# EasyEDA Pro project ProPrj_super_cap_ctrl_v1.0_2025-02-24.epro, schematic 主拓扑部分

## Sheets
1 Buck_Boost: Create Date: 2024-03-09; Page Name: Buck_Boost; Project Name: h桥电路test_v1.0; Schematic Name: 主拓扑部分; Update Date: 2024-06-20; Company: 嘉立创EDA; Page Size: A3; Version: V1.0
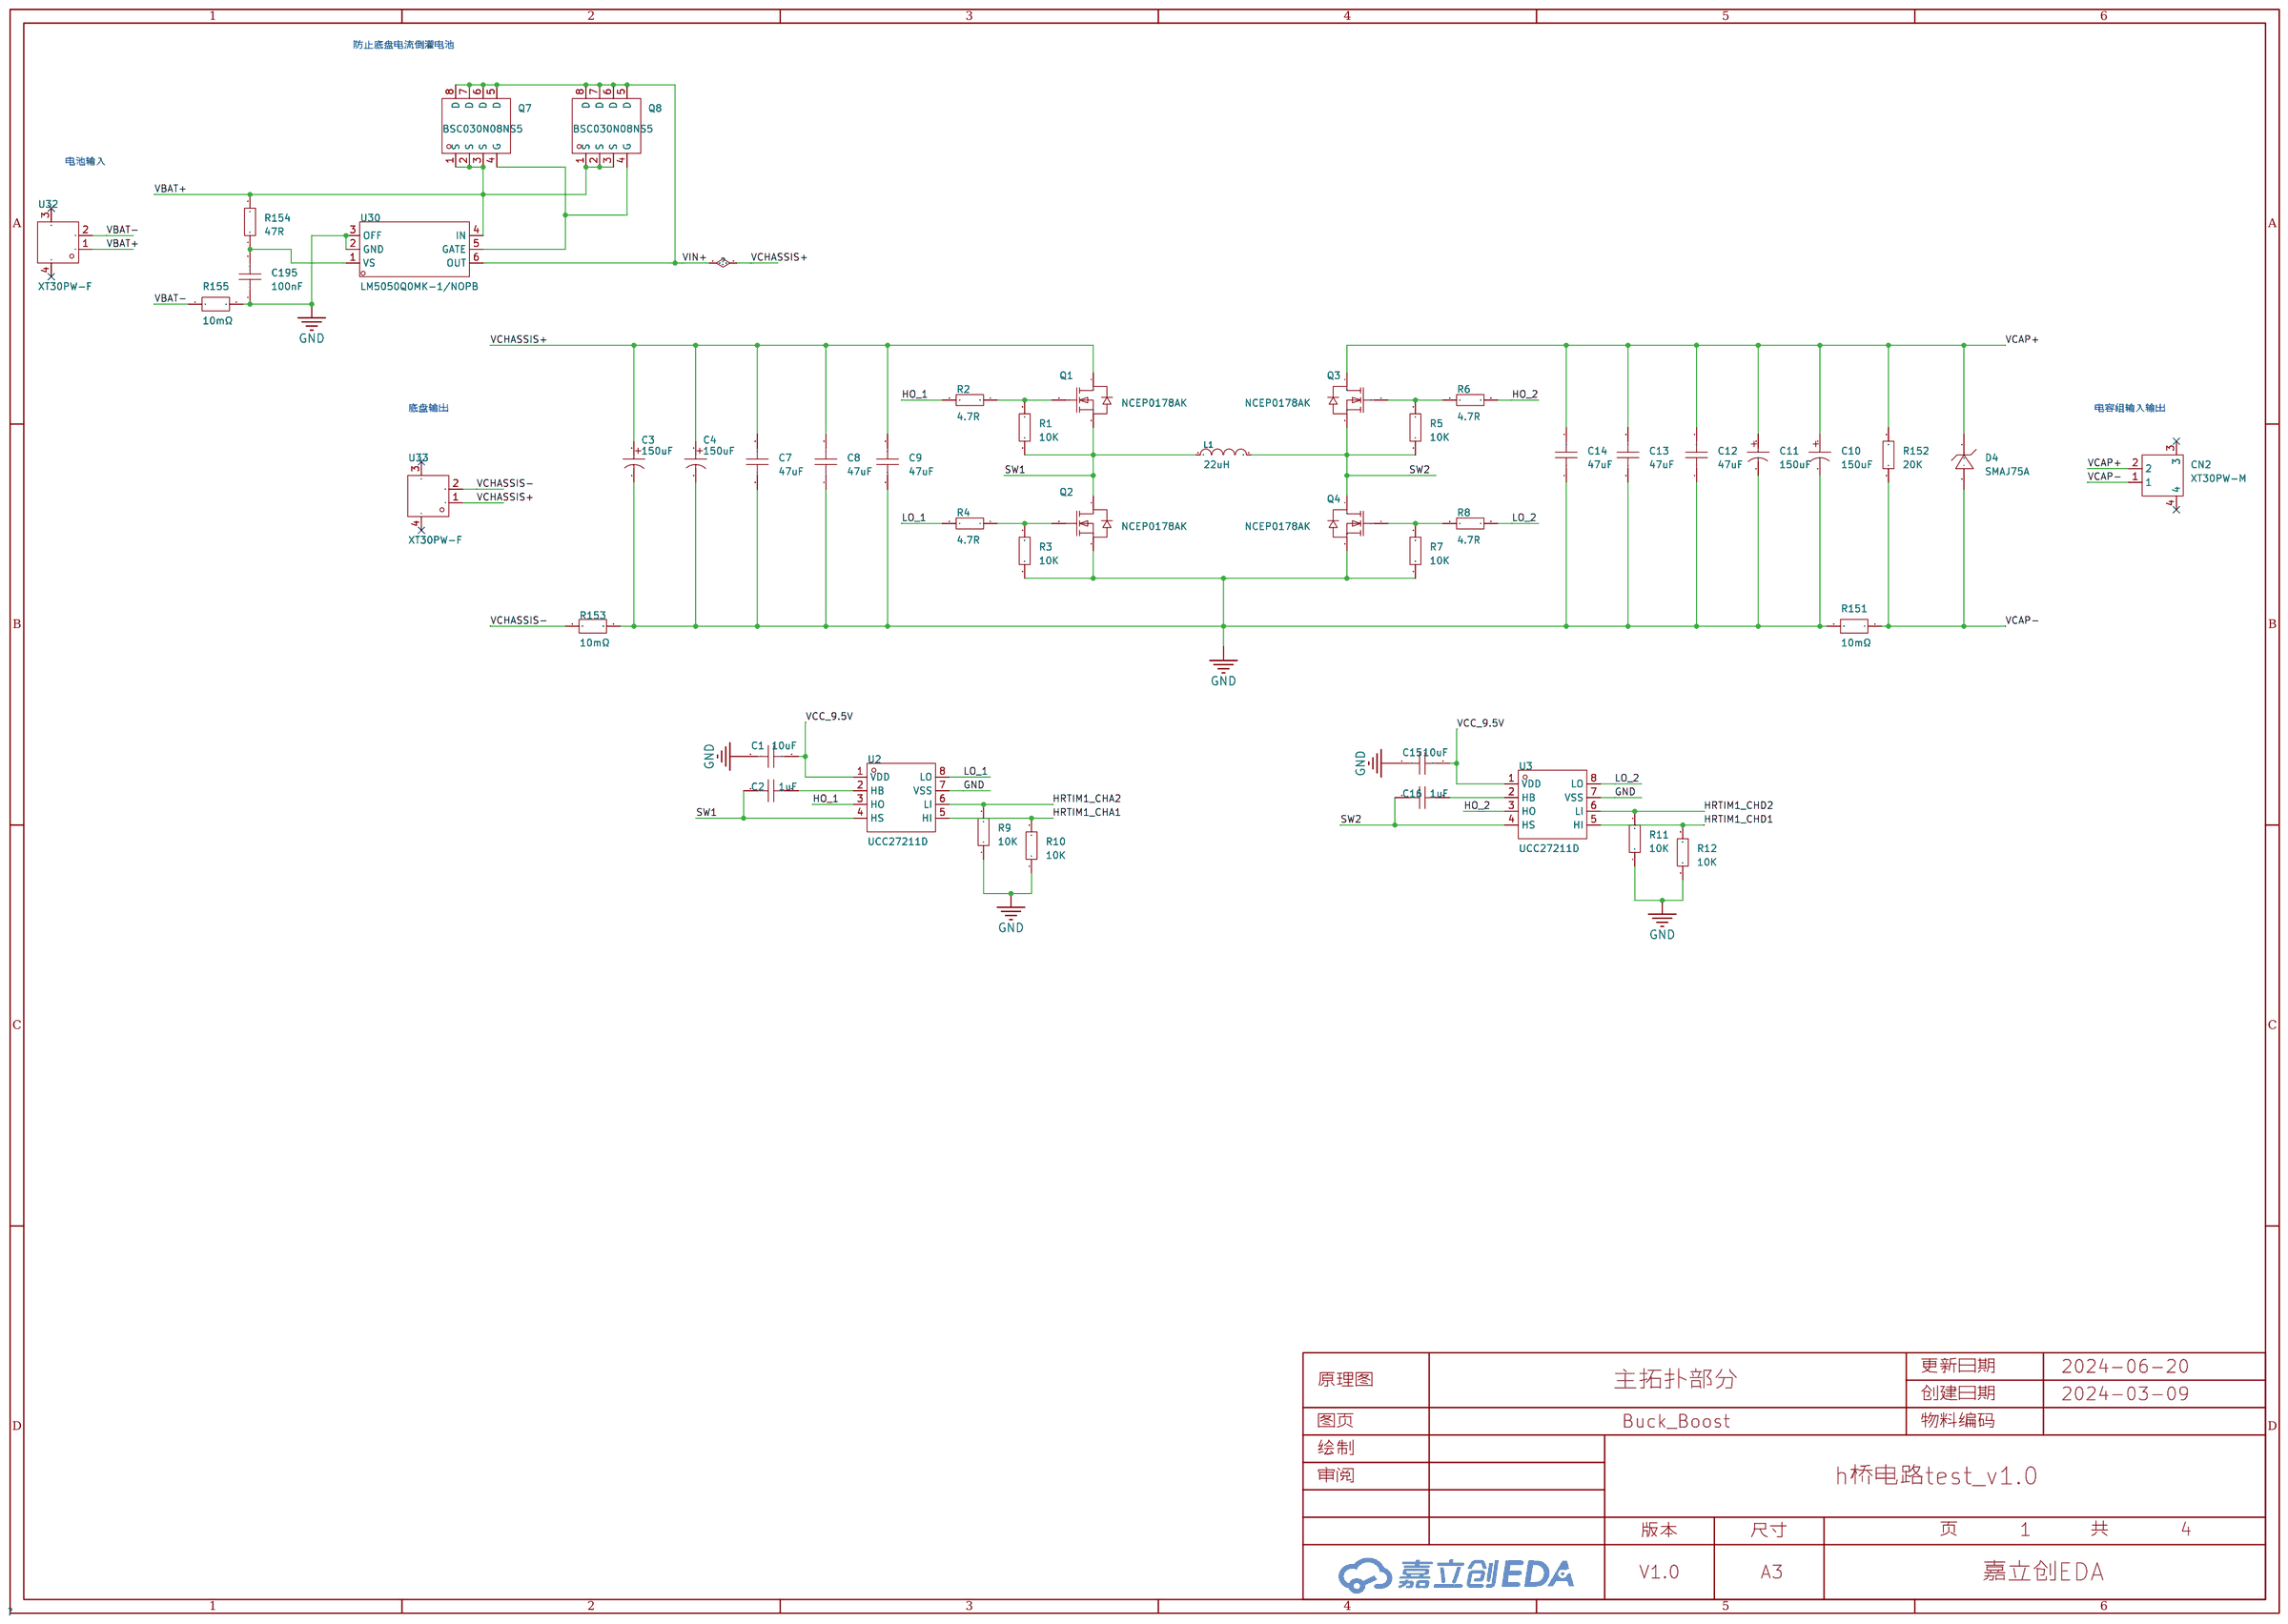
[diagram p0: Buck_Boost]
2 MCU: Create Date: 2024-03-11; Page Name: MCU; Update Date: 2024-05-17; Page Size: A4
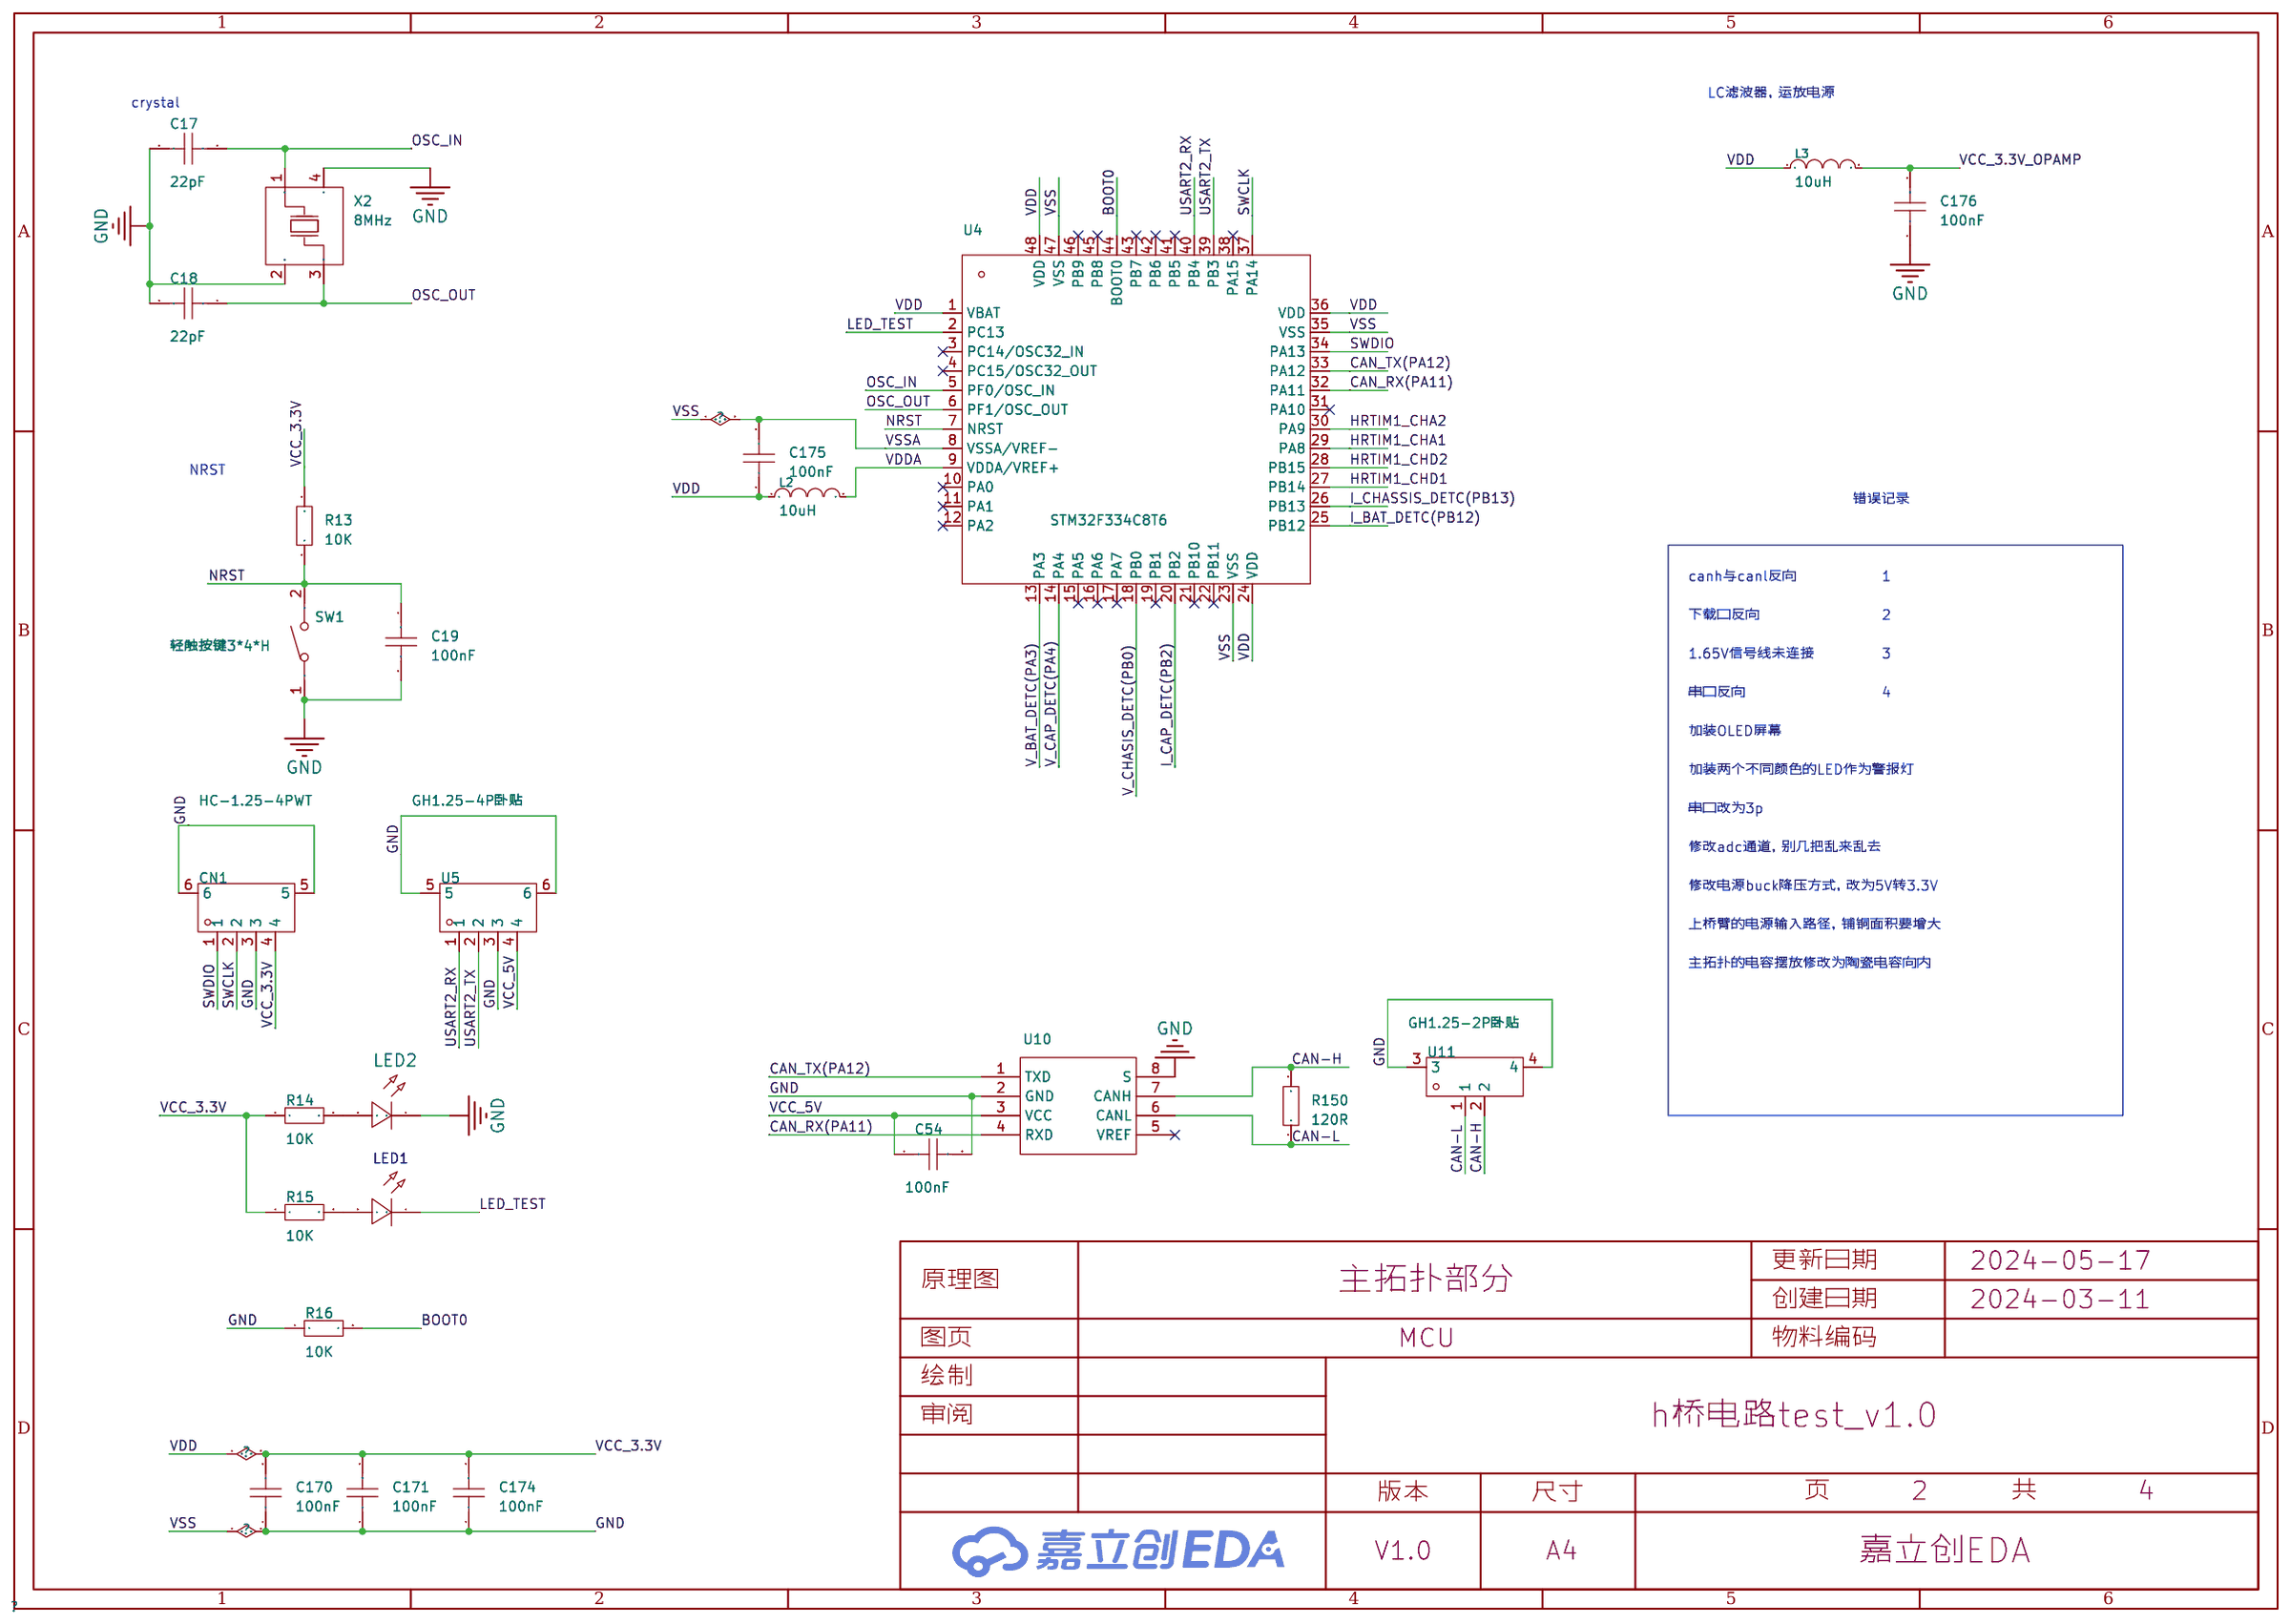
[diagram p1: MCU]
3 信号调理: Board Name: Board1; Create Date: 2024-03-11; Page Name: 信号调理; Update Date: 2024-05-14
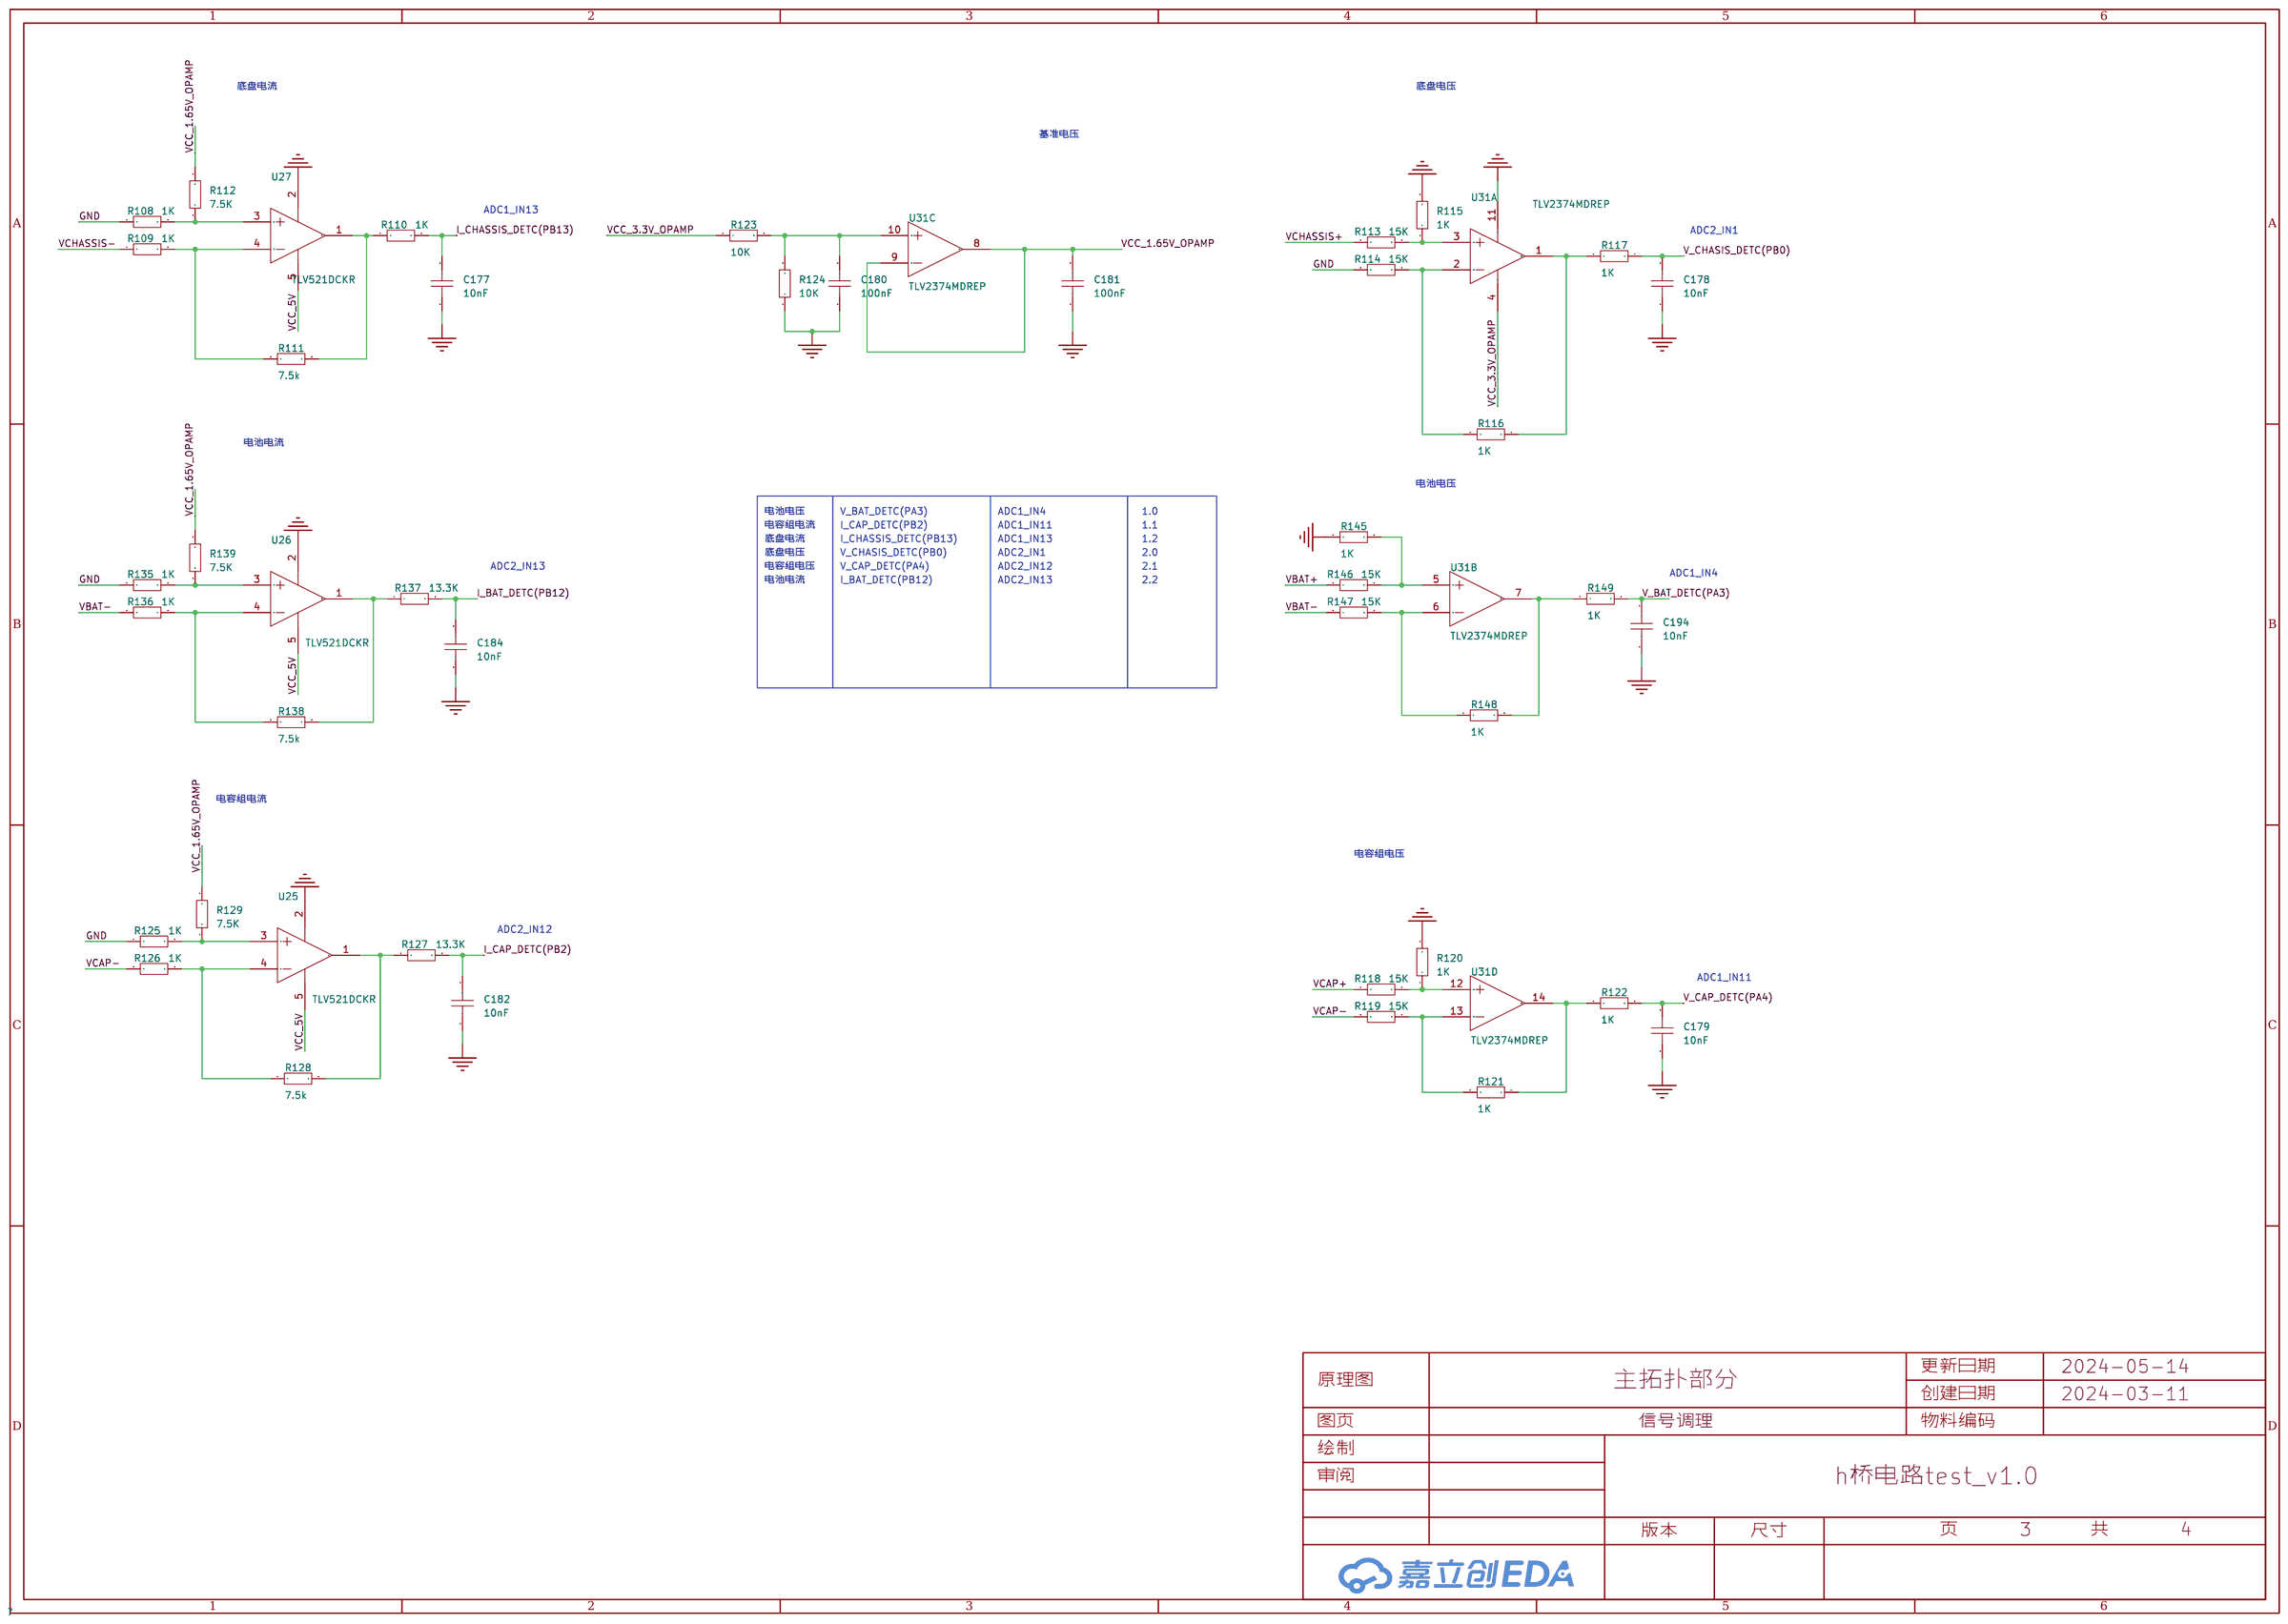
[diagram p2: 信号调理]
4 辅助电源: Create Date: 2024-03-11; Page Name: 辅助电源; Update Date: 2024-03-21; Page Size: A4
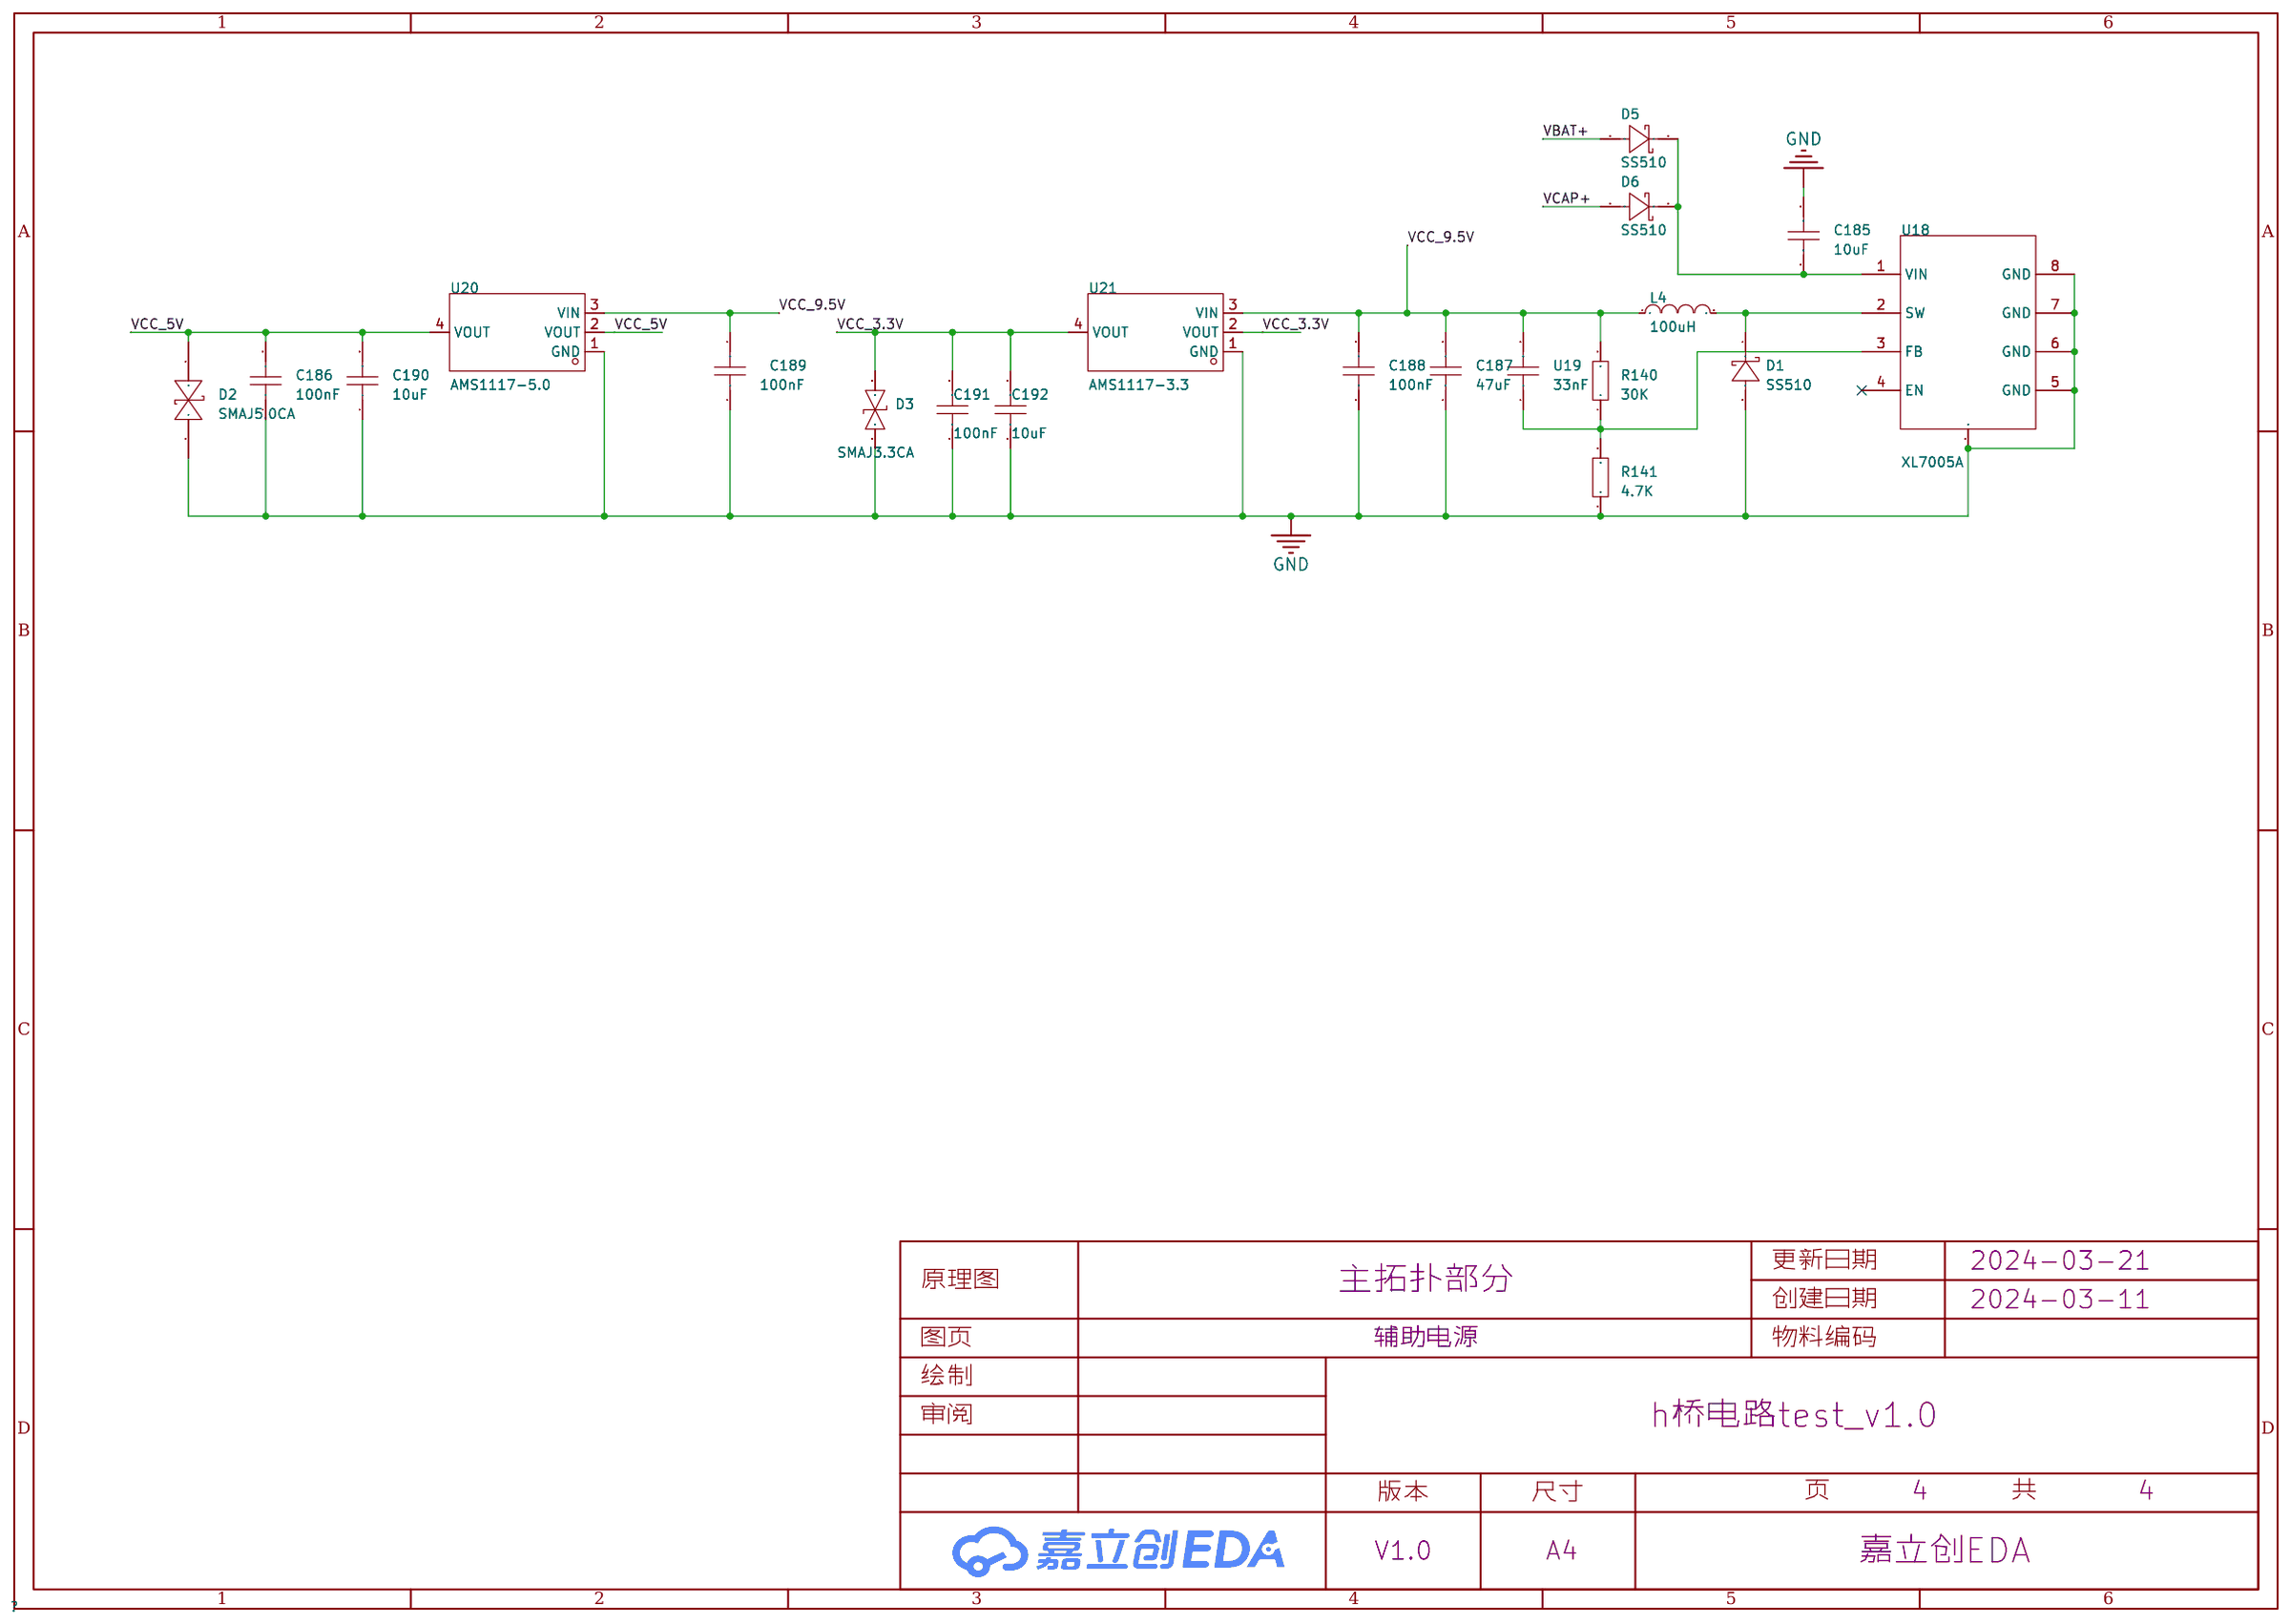
[diagram p3: 辅助电源]

## Parts
sheet Buck_Boost
C1  10uF  [C0603]
C2  1uF  [C0805]
C3  150uF  [CAP-SMD_BD10.0-L10.3-W10.3-LS11.3-FD]
C4  150uF  [CAP-SMD_BD10.0-L10.3-W10.3-LS11.3-FD]
C7  47uF  [C1210]
C8  47uF  [C1210]
C9  47uF  [C1210]
C10  150uF  [CAP-SMD_BD10.0-L10.3-W10.3-LS11.3-FD]
C11  150uF  [CAP-SMD_BD10.0-L10.3-W10.3-LS11.3-FD]
C12  47uF  [C1210]
C13  47uF  [C1210]
C14  47uF  [C1210]
C15  10uF  [C0603]
C16  1uF  [C0805]
C195  100nF  [C0603]
CN2  XT30PW-M  [CONN-TH_XT30PW-M]
D4  SMAJ75A  [SMA_L4.3-W2.6-LS5.0-RD]
L1  22uH  [IND-SMD_L17.2-W17.2]
Q1  NCEP0178AK  [TO-252-2_L6.5-W6.1-P4.58-LS10.0-TL]
Q2  NCEP0178AK  [TO-252-2_L6.5-W6.1-P4.58-LS10.0-TL]
Q3  NCEP0178AK  [TO-252-2_L6.5-W6.1-P4.58-LS10.0-TL]
Q4  NCEP0178AK  [TO-252-2_L6.5-W6.1-P4.58-LS10.0-TL]
Q7  BSC030N08NS5  [PG-TDSON-8_L5.0-W6.0-P1.27-BL-EP]
Q8  BSC030N08NS5  [PG-TDSON-8_L5.0-W6.0-P1.27-BL-EP]
R1  10K  [R0603]
R2  4.7R  [R0603]
R3  10K  [R0603]
R4  4.7R  [R0603]
R5  10K  [R0603]
R6  4.7R  [R0603]
R7  10K  [R0603]
R8  4.7R  [R0603]
R9  10K  [R0603]
R10  10K  [R0603]
R11  10K  [R0603]
R12  10K  [R0603]
R151  10mΩ  [RES-SMD_L6.4-W3.2-R2512]
R152  20K  [R1206]
R153  10mΩ  [RES-SMD_L6.4-W3.2-R2512]
R154  47R  [R0603]
R155  10mΩ  [RES-SMD_L6.4-W3.2-R2512]
U2  UCC27211D  [SOIC-8_L4.9-W3.9-P1.27-LS6.0-BL]
U3  UCC27211D  [SOIC-8_L4.9-W3.9-P1.27-LS6.0-BL]
U30  LM5050Q0MK-1/NOPB  [SOT-23-6_L2.9-W1.6-P0.95-LS2.8-BL]
U32  XT30PW-F  [CONN-TH_XT30PW-F-1]
U33  XT30PW-F  [CONN-TH_XT30PW-F-1]
sheet MCU
C17  22pF  [C0603]
C18  22pF  [C0603]
C19  100nF  [C0603]
C54  100nF  [C0603]
C170  100nF  [C0603]
C171  100nF  [C0603]
C174  100nF  [C0603]
C175  100nF  [C0603]
C176  100nF  [C0603]
CN1  HC-1.25-4PWT  [CONN-SMD_4P-P1.25-HC-1.25-4PWT]
L2  10uH  [L0603]
L3  10uH  [L0603]
LED1  -  [LED_0603]
LED2  -  [LED_0603]
R13  10K  [R0603]
R14  10K  [R0603]
R15  10K  [R0603]
R16  10K  [R0603]
R150  120R  [R0603]
SW1  轻触按键3*4*H  [SW-SMD_L4.0-W2.9-LS5.0]
U4  STM32F334C8T6  [LQFP-48_L7.0-W7.0-P0.50-LS9.0-BL]
U5  GH1.25-4P卧贴  [CONN-SMD_4P-P1.25_GH1.25-4P]
U10  -  [SOIC-8_L5.0-W4.0-P1.27-LS6.0-BL]
U11  GH1.25-2P卧贴  [CONN-SMD_2P-P1.25_GH1.25-2P]
X2  8MHz  [OSC-SMD_4P-L3.2-W2.5-BL]
sheet 信号调理
C177  10nF  [C0603]
C178  10nF  [C0603]
C179  10nF  [C0603]
C180  100nF  [C0603]
C181  100nF  [C0603]
C182  10nF  [C0603]
C184  10nF  [C0603]
C194  10nF  [C0603]
R108  1K  [R0603]
R109  1K  [R0603]
R110  1K  [R0603]
R111  7.5k  [R0603]
R112  7.5K  [R0603]
R113  15K  [R0603]
R114  15K  [R0603]
R115  1K  [R0603]
R116  1K  [R0603]
R117  1K  [R0603]
R118  15K  [R0603]
R119  15K  [R0603]
R120  1K  [R0603]
R121  1K  [R0603]
R122  1K  [R0603]
R123  10K  [R0603]
R124  10K  [R0603]
R125  1K  [R0603]
R126  1K  [R0603]
R127  13.3K  [R0603]
R128  7.5k  [R0603]
R129  7.5K  [R0603]
R135  1K  [R0603]
R136  1K  [R0603]
R137  13.3K  [R0603]
R138  7.5k  [R0603]
R139  7.5K  [R0603]
R145  1K  [R0603]
R146  15K  [R0603]
R147  15K  [R0603]
R148  1K  [R0603]
R149  1K  [R0603]
U25  TLV521DCKR  [SC-70-5_L2.1-W1.3-P0.65-LS2.1-BR]
U26  TLV521DCKR  [SC-70-5_L2.1-W1.3-P0.65-LS2.1-BR]
U27  TLV521DCKR  [SC-70-5_L2.1-W1.3-P0.65-LS2.1-BR]
U31  TLV2374MDREP  [SOIC-14_L8.7-W3.9-P1.27-LS6.0-BL]  (sections 1,2,3,4)
sheet 辅助电源
C185  10uF  [C1206]
C186  100nF  [C0603]
C187  47uF  [C1206]
C188  100nF  [C0603]
C189  100nF  [C0603]
C190  10uF  [C0603]
C191  100nF  [C0603]
C192  10uF  [C0603]
D1  SS510  [SMB_L4.3-W3.6-LS5.4-RD]
D2  SMAJ5.0CA  [SMA_L4.4-W2.8-LS5.1-BI]
D3  SMAJ3.3CA  [SMA_L4.3-W2.6-LS5.1-BI]
D5  SS510  [SMB_L4.3-W3.6-LS5.4-RD]
D6  SS510  [SMB_L4.3-W3.6-LS5.4-RD]
L4  100uH  [IND-SMD_L4.0-W4.0_FNR40XXS]
R140  30K  [R0603]
R141  4.7K  [R0603]
U18  XL7005A  [SOIC-8_L4.9-W3.9-P1.27-LS6.0-BL-EP3.1-1]
U19  33nF  [C0603]
U20  AMS1117-5.0  [SOT-223_L6.5-W3.5-P2.30-LS7.0-BR]
U21  AMS1117-3.3  [SOT-223-3_L6.5-W3.4-P2.30-LS7.0-BR]

## Library data of the parts
C1 C2 C15-C19 C170 C171 C174-C182 C184-C192 C194 C195 = CAP_0603: Supplier Footprint: 0603
C3 C4 C10 C11 = RVT1H151M1010: 容值:150uF;精度:±20%;额定电压:50V;纹波电流:178mA@120Hz;等效串联电阻:-;; LCSC Part Name: 150uF ±20% 50V; Supplier Part: C72490; Manufacturer: ROQANG(容强); Supplier Footprint: SMD,D10xL10.2mm; JLCPCB Part Class: 扩展库; Datasheet: https://atta.szlcsc.com/upload/public/pdf/source/20170325/1490427950282.pdf; Supplier: LCSC; Tolerance: ±20%; Rated Voltage: 50V; Ripple Current: 178mA@120Hz; φD: 10mm; L: 10.2mm; Lifetime @ Temp: 2000hrs@105℃; Operating Temperature: -40℃~+105℃
C7-C9 C12-C14 = GRM32ER61C476KE15L: 容值:47uF;精度:±10%;额定电压:16V;材质(温度系数):X5R;; LCSC Part Name: 47uF ±10% 16V; Supplier Part: C77101; Manufacturer: muRata(村田); Supplier Footprint: 1210; JLCPCB Part Class: 扩展库; Datasheet: https://atta.szlcsc.com/upload/public/pdf/source/20221202/FF58125DCA7AB78AED268D88B743009A.pdf; Supplier: LCSC; Tolerance: ±10%; Voltage Rated: 16V; Temperature Coefficient: X5R
CN2 = XT30PW-M: 类别:-;类型1:-;; LCSC Part Name: AMASS(艾迈斯)航模插头 卧式弯脚 XT30PW-M公头; Supplier Part: C431092; Manufacturer: AMASS(艾迈斯); JLCPCB Part Class: 扩展库; Datasheet: https://atta.szlcsc.com/upload/public/pdf/source/20220222/6A9F22F7850E25B33E1BE430ADF8560B.pdf; Supplier: LCSC; Brand: 艾迈斯; Type: 航模插头; RatedVoltage: DC 500V; InterfaceType: 公头; RatedCurrent: 15A; RecommendedWireGauge: 16/18/20AWG; contact resistance: 1.2mΩ; specifications: 2pin
D4 = SMAJ75A: 反向截止电压(Vrwm):75V;最大钳位电压:121V;峰值脉冲电流(Ipp)@10/1000us:3.3A;峰值脉冲功率(Ppp)@10/1000us:400W;击穿电压:83.3V;; LCSC Part Name: 单向TVS 75V截止 3.3A峰值脉冲; Supplier Part: C353422; Manufacturer: 晶导微电子; Supplier Footprint: SMA; JLCPCB Part Class: 扩展库; Datasheet: https://atta.szlcsc.com/upload/public/pdf/source/20190103/C353498_9C52E1B7CA7D9691073072057BB1DA1A.pdf; Supplier: LCSC; Reverse Stand-Off Voltage (Vrwm): 75V; Maximum Clamping Voltage: 121V; Peak Pulse Current (Ipp)@10/1000us: 3.3A; Peak Pulse Power Dissipation (Ppp)@10/1000us: 400W; Breakdown Voltage: 83.3V; Reverse Leakage Current (Ir): 1uA; Type: TVS
L1 = FAUL1770-680MT: 电感值:68uH;精度:±20%;额定电流:5.2A;饱和电流(Isat):6.5A;类型:一体成型电感;; LCSC Part Name: 68uH ±20% 6.5A; Supplier Part: C5298369; Manufacturer: cjiang(长江微电); Supplier Footprint: SMD,17.2x17.2mm; JLCPCB Part Class: Extended Part; Datasheet: https://atta.szlcsc.com/upload/public/pdf/source/20221201/43419F042EC034C99E4B70E898E2F3B3.pdf; Supplier: LCSC; Tolerance: ±20%; Rated Current: 5.2A; Saturation Current (Isat): 6.5A; DC Resistance (DCR): 85mΩ; Type: 一体成型电感; Ratings: AEC-Q200
Q1-Q4 = NCEP0178AK: 类型:N沟道;漏源电压(Vdss):100V;连续漏极电流(Id):78A;功率(Pd):125W;导通电阻(RDS(on)@Vgs,Id):8.5mΩ@10V,39A;阈值电压(Vgs(th)@Id):2.2V@250uA;; LCSC Part Name: N沟道 耐压:100V 电流:78A; Supplier Part: C216784; Manufacturer: NCE(无锡新洁能); Supplier Footprint: TO-252-2(DPAK); JLCPCB Part Class: 扩展库; Datasheet: https://atta.szlcsc.com/upload/public/pdf/source/20180614/C216784_4CC9571F208305EE00914CFFBA9F145C.pdf; Supplier: LCSC; Type: N沟道; Drain Source Voltage (Vdss): 100V; Continuous Drain Current (Id): 78A; Power Dissipation (Pd): 125W; Drain Source On Resistance (RDS(on)@Vgs,Id): 8.5mΩ@10V,39A; Gate Threshold Voltage (Vgs(th)@Id): 2.2V@250uA
Q7 Q8 = BSC030N08NS5: 类型:N沟道;漏源电压(Vdss):80V;连续漏极电流(Id):100A;功率(Pd):2.5W;导通电阻(RDS(on)@Vgs,Id):3mΩ@10V,50A;阈值电压(Vgs(th)@Id):3.8V@95uA;; LCSC Part Name: N沟道 耐压:80V 电流:100A; Supplier Part: C501507; Manufacturer: Infineon(英飞凌); Supplier Footprint: TDSON-8-EP(5x6); JLCPCB Part Class: 扩展库; Datasheet: https://atta.szlcsc.com/upload/public/pdf/source/20200324/C501507_9C7B62D74123036478B65B3B25F9DBA5.pdf; Supplier: LCSC; Type: N沟道; Drain Source Voltage (Vdss): 80V; Continuous Drain Current (Id): 100A; Power Dissipation (Pd): 2.5W; Drain Source On Resistance (RDS(on)@Vgs,Id): 3mΩ@10V,50A; Gate Threshold Voltage (Vgs(th)@Id): 3.8V@95uA
R1-R16 R108-R129 R135-R141 R145-R150 R152 R154 = Res_0603: Supplier Footprint: 0603
R151 R153 R155 = HoJLR2512-3W-10mR-1%: 电阻类型:采样电阻;阻值:10mΩ;精度:±1%;功率:3W;安装方式:贴片;; LCSC Part Name: 10mΩ ±1% 3W; Supplier Part: C2903468; Manufacturer: Milliohm(毫欧); Supplier Footprint: 2512; JLCPCB Part Class: 扩展库; Datasheet: https://atta.szlcsc.com/upload/public/pdf/source/20211009/7525CABAB363C979E942C1DD41F1FEF0.pdf; Supplier: LCSC; Type: 采样电阻; Tolerance: ±1%; Power(Watts): 3W; Mounting Sytle: 贴片
U2 U3 = UCC27211D: 驱动配置:半桥;负载类型:MOSFET;驱动通道数:2;峰值灌电流:4A;峰值拉电流:4A;电源电压:8V~17V;上升时间:7.2ns;下降时间:5.5ns;; Supplier Part: C1549388; Manufacturer: TI(德州仪器); Supplier Footprint: SOIC-8; JLCPCB Part Class: 扩展库; Datasheet: https://www.ti.com/cn/lit/gpn/ucc27211; Supplier: LCSC; Driven Configuration: 半桥; Load Type: MOSFET; Number of Drivers: 2; Peak Output Current(sink): 4A; Peak Output Current(source): 4A; Supply Voltage: 8V~17V; Rise Time: 7.2ns; Fall Time: 5.5ns; Operating Temperature: -40℃~+140℃@(Tj)
U30 = LM5050Q0MK-1/NOPB: 输入电压:5V~75V;; Supplier Part: C181306; Manufacturer: TI(德州仪器); Supplier Footprint: SOT-23-6; JLCPCB Part Class: 扩展库; Datasheet: https://www.ti.com/cn/lit/gpn/lm5050-1-q1; Supplier: LCSC; Input Voltage: 5V~75V; Operating Temperature	-: -40℃~+150℃
U32 U33 = XT30PW-F: 类别:-;类型1:-;; LCSC Part Name: AMASS(艾迈斯)电源连接器 母头 XT30PW-F; Supplier Part: C2913282; Manufacturer: AMASS(艾迈斯); JLCPCB Part Class: 扩展库; Datasheet: https://atta.szlcsc.com/upload/public/pdf/source/20231218/06CFCF98887A9A87638B0856A725C8FD.pdf; Supplier: LCSC; Brand: 艾迈斯; Type: 航模插头; InterfaceType: 母头
C54 = CC0603KRX7R9BB104: 容值:100nF;精度:±10%;额定电压:50V;材质(温度系数):X7R;; LCSC Part Name: 100nF ±10% 50V; Supplier Part: C14663; Manufacturer: YAGEO(国巨); Supplier Footprint: 0603; JLCPCB Part Class: Basic Part; Datasheet: https://atta.szlcsc.com/upload/public/pdf/source/20180910/C282072_33301C7F631E79921B82A8DAC6BCC5B3.pdf; Supplier: LCSC; Tolerance: ±10%; Voltage Rated: 50V; Temperature Coefficient: X7R
CN1 = HC-1.25-4PWT: 插针结构:1x4P;间距:1.25mm;安装方式:卧贴;参考系列:-;总PIN数:4P;排数:1;每排PIN数:4;行距:-;额定电流:2A;触头材质:黄铜;触头镀层:锡;工作温度范围:-25℃~+85℃;; LCSC Part Name: 1x4P 间距:1.25mm 卧贴; Supplier Part: C2845381; Manufacturer: HCTL(华灿天禄); Supplier Footprint: SMD,P=1.25mm,卧贴; JLCPCB Part Class: 扩展库; Datasheet: https://atta.szlcsc.com/upload/public/pdf/source/20230707/D26CCCA63A4ED0B68E63A615510D7FF9.pdf; Supplier: LCSC; Pins Structure: 1x4P; Pitch: 1.25mm; Mounting Style: 卧贴; Number of Pins: 4P; Number of Rows: 1; Number of PINs Per Row: 4; Current Rating (Max): 2A; Contact Material: 黄铜; Contact Plating: 锡; Operating Temperature Range: -25℃~+85℃
L2 L3 = L_0603
LED1 = LED_0603-B: Supplier Footprint: 0603
LED2 = LED_0603-R: Supplier Footprint: 0603
SW1 = 轻触按键3*4*H: Supplier Part: C9900017573; Supplier Footprint: 轻触按键3*4*2.5; JLCPCB Part Class: 扩展库; Datasheet: https://atta.szlcsc.comnull; Supplier: LCSC
U4 = STM32F334C8T6: CPU内核:CM4;程序存储容量:64KB;RAM总容量:12KB;GPIO端口数量:37;工作电压范围:2V~3.6V;CPU最大主频:72MHz;程序存储器类型:FLASH;; Supplier Part: C99450; Manufacturer: ST(意法半导体); Supplier Footprint: LQFP-48(7x7); JLCPCB Part Class: 扩展库; Datasheet: https://atta.szlcsc.com/upload/public/pdf/source/20180105/C99450_15151501269081234225.pdf; Supplier: LCSC; CPU Core: CM4; Program Storage Size: 64KB; RAM Size: 12KB; GPIO Ports Number: 37; Operating Voltage Range: 2V~3.6V; CPU Maximum Speed: 72MHz; Program Memory Type: FLASH; Operating Temperature Range: -40℃~+85℃; ADC (Bit): 12bit; DAC (Bit): 12bit; Peripheral/Function: DMA；看门狗；看门狗; Watchdog: 有; Infrared Data Association: 有; Low-Voltage Detect: 有; Direct Memory Access: 有; Internal Oscillator: 有
U5 = GH1.25-4P卧贴: Supplier Part: C9900014670; JLCPCB Part Class: 扩展库; Supplier: LCSC
U10 = TJA1050T/CM,118: 类型:收发器;协议类别:CAN总线;; Supplier Part: C6952; Manufacturer: NXP(恩智浦); Supplier Footprint: SOIC-8_150mil; JLCPCB Part Class: Basic Part; Datasheet: https://atta.szlcsc.com/upload/public/pdf/source/20140411/1457707042917.pdf; Supplier: LCSC; Type: 收发器; Protocol: CAN总线; Supply Voltage: 4.75V ~ 5.25V
U11 = GH1.25-2P卧贴: Supplier Part: C9900014668; JLCPCB Part Class: 扩展库; Supplier: LCSC
X2 = X322525MOB4SI: 频率:25MHz;频率公差:±10ppm;负载电容:12pF;; LCSC Part Name: 25MHz ±10ppm 12pF YSX321SL; Supplier Part: C9006; Manufacturer: YXC(扬兴晶振); Supplier Footprint: SMD3225-4P; JLCPCB Part Class: 基础库; Datasheet: https://atta.szlcsc.com/upload/public/pdf/source/20210329/C112971_1F611BDC486E193C1706F6D8EB5AA189.pdf; Supplier: LCSC; Crystal Type: 贴片无源晶振; Frequency Tolerance: ±10ppm; Frequency Stability: ±30ppm; Load Capacitance: 12pF; Operating Temperature: -40℃~+85℃
U25-U27 = TLV521DCKR: 放大器数:单路;增益带宽积(GBP):6kHz;输入偏置电流(Ib):1pA;压摆率(SR):0.0025V/us;带宽(-3db):-;轨到轨:-;; Supplier Part: C655085; Manufacturer: TI(德州仪器); Supplier Footprint: SC-70-5; JLCPCB Part Class: 扩展库; Datasheet: https://www.ti.com/cn/lit/gpn/tlv521; Supplier: LCSC; Number of Circuits: 单路; Gain Bandwidth Product(GBP): 6kHz; Current - Input Bias(Ib): 1pA; Slew Rate(SR): 0.0025V/us; Output Current: 12mA; Operating Temperature: -40℃~+125℃
U31 = TLV2374MDREP: 放大器数:四路;增益带宽积(GBP):3MHz;输入偏置电流(Ib):1pA;压摆率(SR):2.1V/us;带宽(-3db):-;轨到轨:-;; Supplier Part: C2878572; Manufacturer: TI(德州仪器); Supplier Footprint: SOIC-14; JLCPCB Part Class: 扩展库; Datasheet: https://www.ti.com/cn/lit/gpn/tlv2374-ep; Supplier: LCSC; Number of Circuits: 四路; Gain Bandwidth Product(GBP): 3MHz; Current - Input Bias(Ib): 1pA; Slew Rate(SR): 2.1V/us; Output Current: 16mA; Operating Temperature: -55℃~+125℃
D1 D5 D6 = SS510: 二极管配置:独立式;正向压降(Vf):850mV@5A;直流反向耐压(Vr):100V;平均整流电流(Io):5A;; LCSC Part Name: 电压:100V 电流:5A; Supplier Part: C2898359; Manufacturer: YFW(佑风微); Supplier Footprint: SMB; JLCPCB Part Class: 扩展库; Datasheet: https://atta.szlcsc.com/upload/public/pdf/source/20211008/1A631543609D8D3463D9A042ED2C10D9.pdf; Supplier: LCSC; Diode Configuration: 独立式; Forward Voltage (Vf@If): 850mV@5A; Reverse Voltage (Vr): 100V; Average Rectified Current (Io): 5A; Reverse Leakage Current (Ir): 300uA@100V
D2 = SMAJ5.0CA: 反向截止电压(Vrwm):5V;最大钳位电压:9.2V;峰值脉冲电流(Ipp)@10/1000us:43.5A;击穿电压:6.4V;; LCSC Part Name: 双向TVS 5V截止 43.5A峰值脉冲; Supplier Part: C356748; Manufacturer: JJW(捷捷微); Supplier Footprint: SMA(DO-214AC); JLCPCB Part Class: 扩展库; Datasheet: https://atta.szlcsc.com/upload/public/pdf/source/20190118/C364660_B64EB57815AD6306F3CC88F8ECD7A3CF.pdf; Supplier: LCSC; Reverse Stand-Off Voltage (Vrwm): 5V; Maximum Clamping Voltage: 9.2V; Peak Pulse Current (Ipp)@10/1000us: 43.5A; Breakdown Voltage: 6.4V; Type: TVS
D3 = SMAJ3.3CA: Supplier Part: C9900005096; Supplier Footprint: SMA; JLCPCB Part Class: 扩展库; Supplier: LCSC
L4 = FNR4030S470MT: 电感值:47uH;精度:±20%;额定电流:800mA;饱和电流(Isat):1A;; LCSC Part Name: 47uH ±20% 1A; Supplier Part: C167888; Manufacturer: cjiang(长江微电); Supplier Footprint: SMD,4x4mm; JLCPCB Part Class: 扩展库; Datasheet: https://atta.szlcsc.com/upload/public/pdf/source/20190327/C167925_9EFF0AABC4CA629C2CC95961DBF7D39D.pdf; Supplier: LCSC; Tolerance: ±20%; Rated Current: 800mA; Saturation Current (Isat): 1A; DC Resistance (DCR): 579mΩ
U18 = XL7005A: 功能类型:降压型;输入电压:-;输出电流(最大值):-;; Supplier Part: C50848; Manufacturer: XLSEMI(芯龙); Supplier Footprint: SOIC-8-EP; JLCPCB Part Class: 扩展库; Datasheet: https://atta.szlcsc.com/upload/public/pdf/source/20150821/1457707346919.pdf; Supplier: LCSC; Function: 降压型; Switch tube (built-in/external): 内置
U19 = C3216JB1C336M160AB: 容值:33uF;精度:±20%;额定电压:16V;材质(温度系数):JB;; LCSC Part Name: 33uF ±20% 16V; Supplier Part: C3842845; Manufacturer: TDK; Supplier Footprint: 1206; JLCPCB Part Class: 扩展库; Datasheet: https://atta.szlcsc.com/upload/public/pdf/source/20230606/A83975C7E70EF5AFCD4A17254ABD78F2.pdf; Supplier: LCSC; Tolerance: ±20%; Voltage Rated: 16V; Temperature Coefficient: JB
U20 = AMS1117-5.0_C6187: 输出类型:固定;最大输入电压:12V;输出电压:5V;最大输出电流:1A;电源纹波抑制比(PSRR):68dB@(120Hz);输出极性:正极;; LCSC Part Name: 输入12V 输出5V 1A; Supplier Part: C6187; Manufacturer: AMS; Supplier Footprint: SOT-223; JLCPCB Part Class: 基础库; Datasheet: https://atta.szlcsc.com/upload/public/pdf/source/20230918/E4B716057EE82179D88E8A0894830D59.pdf; Supplier: LCSC; Output Type: 固定; Maximum Input Voltage: 12V; Output Voltage: 5V; MAX Output Current: 1A; Power Supply Rejection Ratio (PSRR): 68dB@(120Hz); Dropout Voltage: 1.3V@(1A); Output Polarity: 正极; Number of Outputs: 1
U21 = AMS1117-3.3_C6186: 输出类型:固定;最大输入电压:-;输出电压:3.3V;最大输出电流:1A;电源纹波抑制比(PSRR):72dB@(120Hz);输出极性:正极;; LCSC Part Name: 输出3.3V 1A; Supplier Part: C6186; Manufacturer: AMS; Supplier Footprint: SOT-223-3; JLCPCB Part Class: 基础库; Datasheet: https://atta.szlcsc.com/upload/public/pdf/source/20180727/C6186_7A095716F0823C02F1997A905E26C086.pdf; Supplier: LCSC; Output Type: 固定; Output Voltage: 3.3V; MAX Output Current: 1A; Power Supply Rejection Ratio (PSRR): 72dB@(120Hz); Dropout Voltage: 1.3V@(800mA); Output Polarity: 正极; Number of Outputs: 1

## Nets
GND: C1.1 C3.2 C4.2 C7.1 C8.1 C9.1 C10.2 C11.2 C12.1 C13.1 C14.1 C15.1 C17.2 C18.2 C19.2 C54.2 C170.1 C171.1 C174.1 C175.2 C176.1 C177.1 C178.1 C179.1 C180.1 C181.1 C182.1 C184.1 C185.2 C186.1 C187.1 C188.1 C189.1 C190.1 C191.1 C192.1 C194.1 C195.1 CN1.3 CN1.5 CN1.6 D1.2(A) D2.1 D3.1 LED2.1(C) Q2.3(S) Q4.3(S) R3.1 R7.1 R9.1 R10.1 R11.1 R12.1 R16.1 R108.1 R114.1 R115.2 R120.2 R124.1 R125.1 R135.1 R141.1 R145.1 R151.2 R153.2 R155.1 SW1.1 U2.7(VSS) U3.7(VSS) U4.8(VSSA/VREF-) U4.23(VSS) U4.35(VSS) U4.47(VSS) U5.3 U5.5 U5.6 U10.2(GND) U10.8(S) U11.3 U11.4 U18.5(GND) U18.6(GND) U18.7(GND) U18.8(GND) U18.9 U20.1(GND) U21.1(GND) U25.2(V-) U26.2(V-) U27.2(V-) U30.2(GND) U30.3(OFF) U31.11(GND) X2.2(GND) X2.4(GND)
VBAT+: D5.2(A) Q7.1(S) Q7.2(S) Q7.3(S) Q8.1(S) Q8.2(S) Q8.3(S) R146.1 R154.2 U30.4(IN) U32.1
VBAT-: R136.1 R147.1 R155.2 U32.2
VCC_1.65V_OPAMP: C181.2 R112.2 R129.2 R139.2 U31.8(3OUT) U31.9(3IN−)
VCC_3.3V: C170.2 C171.2 C174.2 C175.1 C191.2 C192.2 CN1.4 D3.2 L2.1 L3.1 R13.2 R14.1 R15.1 U4.1(VBAT) U4.24(VDD) U4.36(VDD) U4.48(VDD) U21.2(VOUT) U21.4(VOUT)
VCC_3.3V_OPAMP: C176.2 L3.2 R123.1 U31.4(VDD)
VCC_5V: C54.1 C186.2 C190.2 D2.2 U5.4 U10.3(VCC) U20.2(VOUT) U20.4(VOUT) U25.5(V+) U26.5(V+) U27.5(V+)
VCC_9.5V: C1.2 C15.2 C187.2 C188.2 C189.2 L4.1 R140.2 U2.1(VDD) U3.1(VDD) U19.2 U20.3(VIN) U21.3(VIN)
VDDA: L2.2 U4.9(VDDA/VREF+)
BOOT0: R16.2 U4.44(BOOT0)
CAN-H: R150.2 U10.7(CANH) U11.2
CAN-L: R150.1 U10.6(CANL) U11.1
CAN_RX(PA11): U4.32(PA11) U10.4(RXD)
CAN_TX(PA12): U4.33(PA12) U10.1(TXD)
HO_1: R2.2 U2.3(HO)
HO_2: R6.2 U3.3(HO)
HRTIM1_CHA1: R10.2 U2.5(HI) U4.29(PA8)
HRTIM1_CHA2: R9.2 U2.6(LI) U4.30(PA9)
HRTIM1_CHD1: R12.2 U3.5(HI) U4.27(PB14)
HRTIM1_CHD2: R11.2 U3.6(LI) U4.28(PB15)
I_BAT_DETC(PB12): C184.2 R137.2 U4.25(PB12)
I_CAP_DETC(PB2): C182.2 R127.2 U4.20(PB2)
I_CHASSIS_DETC(PB13): C177.2 R110.2 U4.26(PB13)
LED_TEST: LED1.1(C) U4.2(PC13)
LO_1: R4.2 U2.8(LO)
LO_2: R8.2 U3.8(LO)
NRST: C19.1 R13.1 SW1.2 U4.7(NRST)
OSC_IN: C17.1 U4.5(PF0/OSC_IN) X2.1(OSC1)
OSC_OUT: C18.1 U4.6(PF1/OSC_OUT) X2.3(OSC2)
SW1: C2.1 L1.1 Q1.3(S) Q2.4(D) R1.1 U2.4(HS)
SW2: C16.1 L1.2 Q3.3(S) Q4.4(D) R5.1 U3.4(HS)
SWCLK: CN1.2 U4.37(PA14)
SWDIO: CN1.1 U4.34(PA13)
USART2_RX: U4.40(PB4) U5.1
USART2_TX: U4.39(PB3) U5.2
V_BAT_DETC(PA3): C194.2 R149.2 U4.13(PA3)
V_CAP_DETC(PA4): C179.2 R122.1 U4.14(PA4)
V_CHASIS_DETC(PB0): C178.2 R117.1 U4.18(PB0)
VCAP+: C10.1 C11.1 C12.2 C13.2 C14.2 CN2.2 D4.1(C) D6.2(A) Q3.4(D) R118.1 R152.2
VCAP-: CN2.1 D4.2(A) R119.1 R126.1 R151.1 R152.1
VCHASSIS+: C3.1 C4.1 C7.2 C8.2 C9.2 Q1.4(D) Q7.5(D) Q7.6(D) Q7.7(D) Q7.8(D) Q8.5(D) Q8.6(D) Q8.7(D) Q8.8(D) R113.1 U30.6(OUT) U33.1
VCHASSIS-: R109.1 R153.1 U33.2
$1N418: C2.2 U2.2(HB)
$1N971: Q1.1(G) R1.2 R2.1
$1N1037: Q2.1(G) R3.2 R4.1
$1N1093: Q3.1(G) R5.2 R6.1
$1N1202: Q4.1(G) R7.2 R8.1
$1N4475: C16.2 U3.2(HB)
$1N6839: Q7.4(G) Q8.4(G) U30.5(GATE)
$1N6847: C195.2 R154.1 U30.1(VS)
$2N2900: LED2.2(A) R14.2
$2N2950: LED1.2(A) R15.2
$3N664: R108.2 R112.1 U27.3(IN+)
$3N881: R109.2 R111.1 U27.4(IN-)
$3N890: R110.1 R111.2 U27.1(OUT)
$3N1076: R113.2 R115.1 U31.3(1IN+)
$3N1084: R114.2 R116.2 U31.2(1IN−)
$3N1109: R116.1 R117.2 U31.1(1OUT)
$3N1355: R118.2 R120.1 U31.12(4IN+)
$3N1358: R119.2 R121.2 U31.13(4IN−)
$3N1363: R121.1 R122.2 U31.14(4OUT)
$3N1905: R125.2 R129.1 U25.3(IN+)
$3N1918: R126.2 R128.1 U25.4(IN-)
$3N1923: R127.1 R128.2 U25.1(OUT)
$3N2447: R135.2 R139.1 U26.3(IN+)
$3N2460: R136.2 R138.1 U26.4(IN-)
$3N2465: R137.1 R138.2 U26.1(OUT)
$3N2835: R145.2 R146.2 U31.5(2IN+)
$3N2844: R147.2 R148.1 U31.6(2IN−)
$3N2855: R148.2 R149.1 U31.7(2OUT)
$3N5870: C180.2 R123.2 R124.2 U31.10(3IN+)
$4N541: D1.1(K) L4.2 U18.2(SW)
$4N1271: R140.1 R141.2 U18.3(FB) U19.1
$4N3773: C185.1 D5.1(K) D6.1(K) U18.1(VIN)

Not connected (* = marked no-connect by the designer): CN2 3* 4*; U4 3(PC14/OSC32_IN)* 4(PC15/OSC32_OUT)* 10(PA0)* 11(PA1)* 12(PA2)* 15(PA5)* 16(PA6)* 17(PA7)* 19(PB1)* 21(PB10)* 22(PB11)* 31(PA10)* 38(PA15)* 41(PB5)* 42(PB6)* 43(PB7)* 45(PB8)* 46(PB9)*; U10 5(VREF)*; U18 4(EN)*; U32 3* 4*; U33 3* 4*

## Notes on the sheets
sheet 1
- 防止底盘电流倒灌电池
- 电池输入
- 底盘输出
- 电容组输入输出
sheet 2
- crystal
- LC滤波器，运放电源
- NRST
- 错误记录
- canh与canl反向
- 1
- 下载口反向
- 2
- 1.65V信号线未连接
- 3
- 串口反向
- 4
- 加装OLED屏幕
- 加装两个不同颜色的LED作为警报灯
- 串口改为3p
- 修改adc通道，别几把乱来乱去
- 修改电源buck降压方式，改为5V转3.3V
- 上桥臂的电源输入路径，铺铜面积要增大
- 主拓扑的电容摆放修改为陶瓷电容向内
sheet 3
- 底盘电流
- 底盘电压
- 基准电压
- ADC1_IN13
- ADC2_IN1
- 电池电流
- 电池电压
- 电池电压
- V_BAT_DETC(PA3)
- ADC1_IN4
- 1.0
- 电容组电流
- I_CAP_DETC(PB2)
- ADC1_IN11
- 1.1
- 底盘电流
- I_CHASSIS_DETC(PB13)
- ADC1_IN13
- 1.2
- 底盘电压
- V_CHASIS_DETC(PB0)
- ADC2_IN1
- 2.0
- ADC2_IN13
- 电容组电压
- V_CAP_DETC(PA4)
- ADC2_IN12
- 2.1
- ADC1_IN4
- 电池电流
- I_BAT_DETC(PB12)
- ADC2_IN13
- 2.2
- 电容组电流
- 电容组电压
- ADC2_IN12
- ADC1_IN11
